# EAGLE design genericNode (EAGLE 7.3.0)
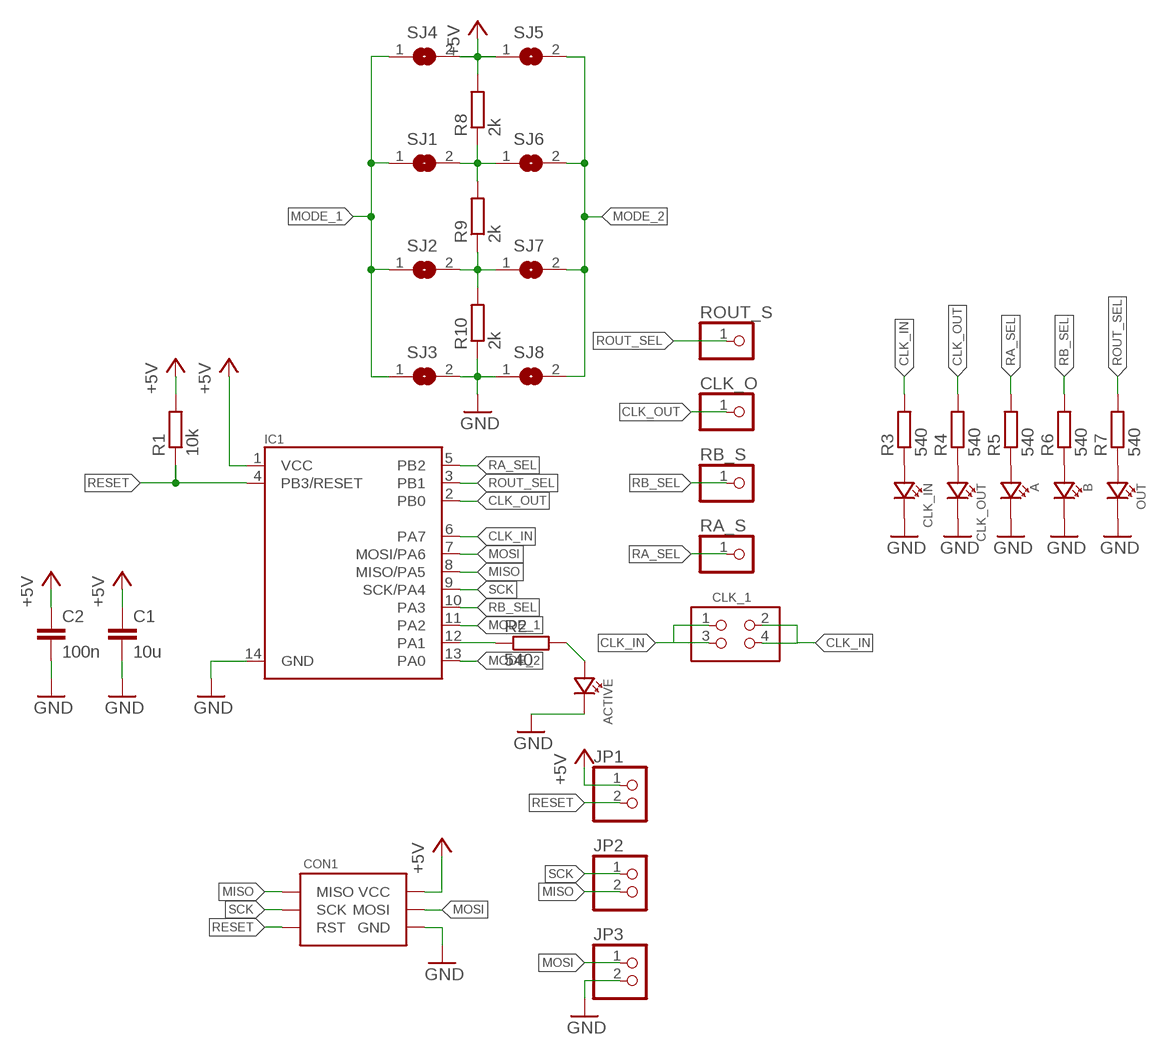
[diagram p0: schematic, sheet 1]

## Parts
A  LED0805  [CHIPLED_0805]
ACTIVE  LED0805  [CHIPLED_0805]
B  LED0805  [CHIPLED_0805]
C1  10u  C-EUC0805  [C0805]
C2  100n  C-EUC0603  [C0603]
CLK_1  GENERIC-2X2-EDGE  [PINHEADER-100MIL-2X2-EDGE]
CLK_IN  LED0805  [CHIPLED_0805]
CLK_O  PINHD-1X1  [1X01]
CLK_OUT  LED0805  [CHIPLED_0805]
CON1  ISP-6_PIN-POGO  [POGO-1.27-6_PIN-MADWORM]
IC1  AVR-ATTINY24/44/84-SOIC14  [SOIC14]
JP1  PINHD-1X2  [1X02]
JP2  PINHD-1X2  [1X02]
JP3  PINHD-1X2  [1X02]
OUT  LED0805  [CHIPLED_0805]
R1  10k  R-EU_R0603  [R0603]
R2  540  R-EU_R0603  [R0603]
R3  540  R-EU_R0603  [R0603]
R4  540  R-EU_R0603  [R0603]
R5  540  R-EU_R0603  [R0603]
R6  540  R-EU_R0603  [R0603]
R7  540  R-EU_R0603  [R0603]
R8  2k  R-EU_R0603  [R0603]
R9  2k  R-EU_R0603  [R0603]
R10  2k  R-EU_R0603  [R0603]
RA_S  PINHD-1X1  [1X01]
RB_S  PINHD-1X1  [1X01]
ROUT_S  PINHD-1X1  [1X01]
SJ1  SJ  [SJ]
SJ2  SJ  [SJ]
SJ3  SJ  [SJ]
SJ4  SJ  [SJ]
SJ5  SJ  [SJ]
SJ6  SJ  [SJ]
SJ7  SJ  [SJ]
SJ8  SJ  [SJ]

## Nets
+5V: C1.1 C2.1 CON1.P$2(VCC) IC1.1(VCC) JP1.1 R1.2 R8.2 SJ4.2 SJ5.1
CLK_IN: CLK_1.1 CLK_1.2 CLK_1.3 CLK_1.4 IC1.6(PA7) R3.2
CLK_OUT: CLK_O.1 IC1.2(PB0) R4.2
GND: A.C ACTIVE.C B.C C1.2 C2.2 CLK_IN.C CLK_OUT.C CON1.P$6(GND) IC1.14(GND) JP3.2 OUT.C R10.1 SJ3.2 SJ8.1
MISO: CON1.P$1(MISO) IC1.8(MISO/PA5) JP2.2
MODE_1: IC1.11(PA2) SJ1.1 SJ2.1 SJ3.1 SJ4.1
MODE_2: IC1.13(PA0) SJ5.2 SJ6.2 SJ7.2 SJ8.2
MOSI: CON1.P$4(MOSI) IC1.7(MOSI/PA6) JP3.1
N$1: ACTIVE.A R2.2
N$2: IC1.12(PA1) R2.1
N$3: CLK_IN.A R3.1
N$4: CLK_OUT.A R4.1
N$5: A.A R5.1
N$6: B.A R6.1
N$7: R9.1 R10.2 SJ2.2 SJ7.1
N$8: R8.1 R9.2 SJ1.2 SJ6.1
N$9: OUT.A R7.1
RA_SEL: IC1.5(PB2) R5.2 RA_S.1
RB_SEL: IC1.10(PA3) R6.2 RB_S.1
RESET: CON1.P$5(RST) IC1.4(PB3/RESET) JP1.2 R1.1
ROUT_SEL: IC1.3(PB1) R7.2 ROUT_S.1
SCK: CON1.P$3(SCK) IC1.9(SCK/PA4) JP2.1

## Library data of the parts
A ACTIVE B CLK_IN CLK_OUT OUT = p.peter-leds:LED
C1 C2 = p.peter-rcl:C-EU: CAPACITOR, European symbol
CLK_1 = p.peter-connectors:GENERIC-2X2
CLK_O RA_S RB_S ROUT_S = pinhead:PINHD-1X1: PIN HEADER
CON1 = p.peter-connectors:ISP-6_PIN: AVR 6 PIN ISP header Edge connector normal layout
IC1 = p.peter-ics:AVR-ATTINY24/44/84
JP1-JP3 = pinhead:PINHD-1X2: PIN HEADER
R1-R10 = p.peter-rcl:R-EU_: RESISTOR, European symbol
SJ1-SJ8 = jumper:SJ: SMD solder JUMPER

## Board
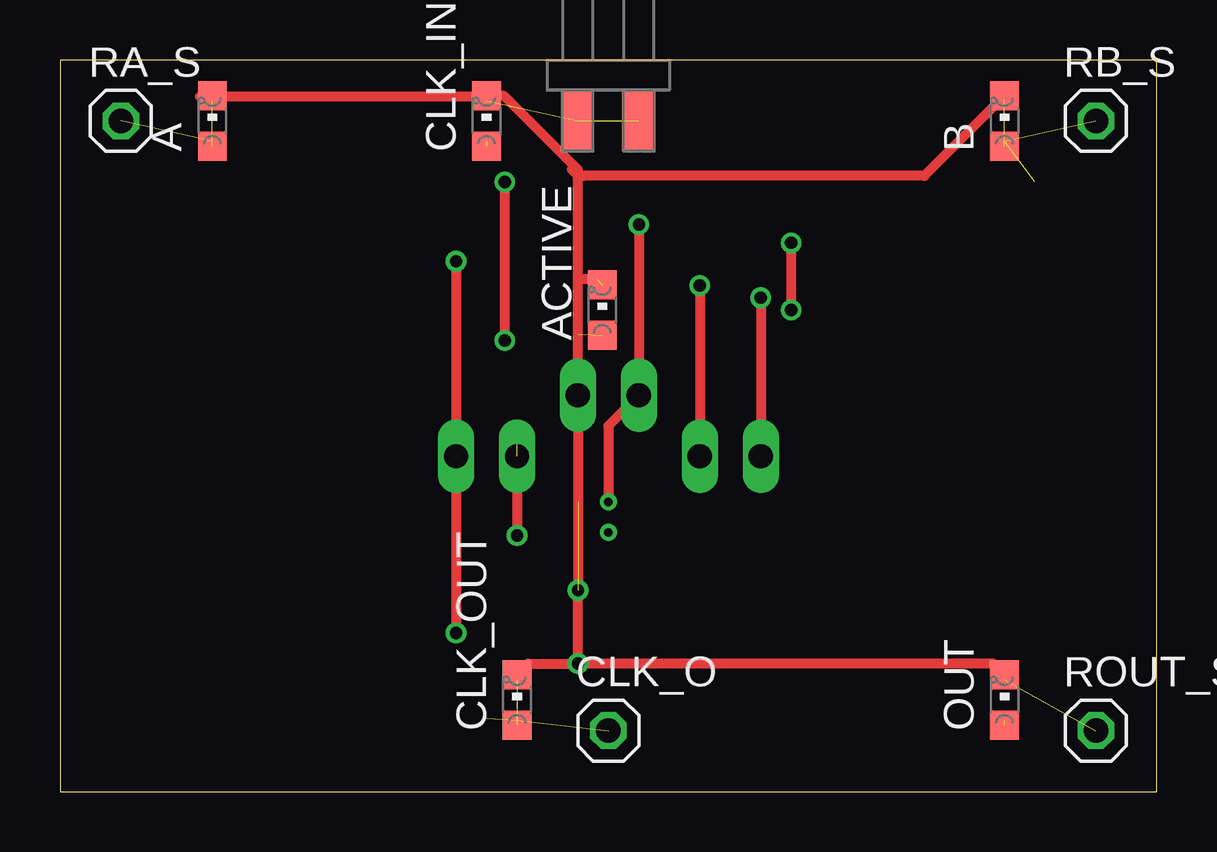
[diagram p1: board, top side]
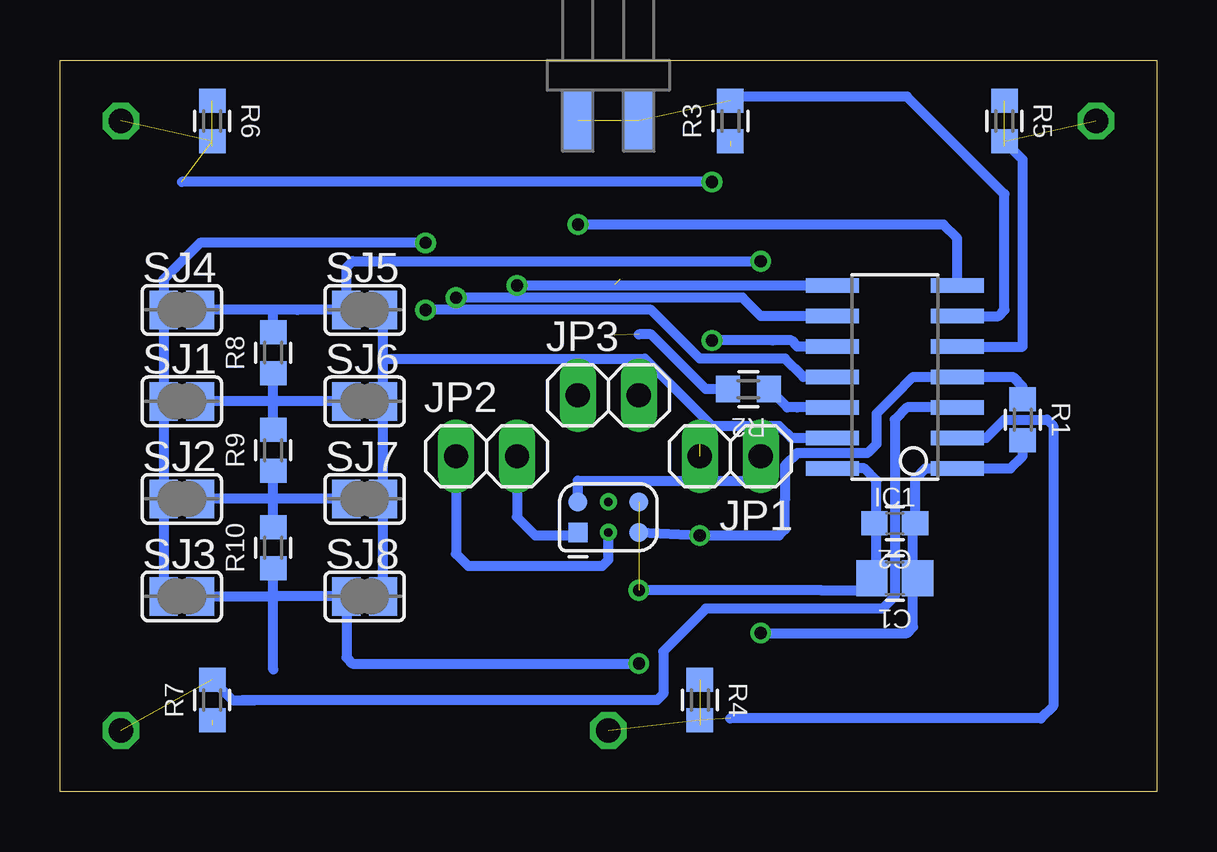
[diagram p2: board, bottom side, seen from below]

Size 45.72 x 30.48 mm. Coordinates in mm from the lower left corner, seen from the top.
Outline: 0,30.48 0,0
Outline: 5.08,30.48 0,30.48
Outline: 0,30.48 0,0
Outline: 0,0 45.72,0 45.72,30.48 5.08,30.48
Outline: 5.08,30.48 0,30.48
Copper layers (1*16): Top 0.0356mm / dielectric 1.5011mm / Bottom 0.0356mm
Design rules "oshpark": minimum track width 6mil, minimum drill 13mil, track to track 6mil, track to pad 6mil, pad to pad 6mil, via to via 6mil, smd to smd 6mil, copper to edge 15mil, drill to drill 6mil, minimum pad ring 7mil, minimum via ring 7mil, stop-mask expansion 4mil, vias tented up to drill 4.1mm, thermal gap 10mil

### Footprints (pad centres in the part's own frame; a part is rotated, then mirrored left to right if it is on the bottom)
CHIPLED_0805 = smd 1.2 x 1.2: A 0,-1.05; C 0,1.05
C0805 = smd 1.3 x 1.5: 1 -0.95,0; 2 0.95,0
C0603 = smd 1.1 x 1: 1 -0.85,0; 2 0.85,0
PINHEADER-100MIL-2X2-EDGE = smd 1.27 x 2.54 bottom: 1 -1.27,1.27; 3 1.27,1.27 | smd 1.27 x 2.54: 2 -1.27,1.27; 4 1.27,1.27
1X01 = drill 1.016 octagon: 1 0,0
POGO-1.27-6_PIN-MADWORM = smd 0.8 x 0.8: P$1 -1.27,-0.635; P$2 -1.27,0.635; P$5 1.27,-0.635; P$6 1.27,0.635 | drill 0.35: P$3 0,-0.635; P$4 0,0.635
SOIC14 = smd 0.61 x 2.21: 1 -3.81,-2.603; 2 -2.54,-2.603; 3 -1.27,-2.603; 4 0,-2.603; 5 1.27,-2.603; 6 2.54,-2.603; 7 3.81,-2.603; 8 3.81,2.603; 9 2.54,2.603; 10 1.27,2.603; 11 0,2.603; 12 -1.27,2.603; 13 -2.54,2.603; 14 -3.81,2.603
1X02 = drill 1.016 long: 1 -1.27,0; 2 1.27,0
R0603 = smd 1 x 1.1: 1 -0.85,0; 2 0.85,0
SJ = smd 1.168 x 1.6: 1 -0.762,0; 2 0.762,0

### Placement (x,y rotation side)
A  6.35,27.94 0 top
ACTIVE  22.61,20.07 0 top
B  39.37,27.94 0 top
C1  10.92,8.89 180 bottom
C2  10.92,11.18 180 bottom
CLK_1  22.86,29.21 180 top
CLK_IN  17.78,27.94 0 top
CLK_O  22.86,2.54 0 top
CLK_OUT  19.05,3.81 0 top
CON1  22.86,11.43 0 bottom
IC1  10.92,17.27 90 bottom
JP1  17.78,13.97 180 bottom
JP2  27.94,13.97 0 bottom
JP3  22.86,16.51 0 bottom
OUT  39.37,3.81 0 top
R1  5.59,15.49 270 bottom
R2  17.02,16.76 180 bottom
R3  17.78,27.94 90 bottom
R4  19.05,3.81 270 bottom
R5  6.35,27.94 270 bottom
R6  39.37,27.94 270 bottom
R7  39.37,3.81 90 bottom
R8  36.83,18.29 90 bottom
R9  36.83,14.22 90 bottom
R10  36.83,10.16 90 bottom
RA_S  2.54,27.94 0 top
RB_S  43.18,27.94 0 top
ROUT_S  43.18,2.54 0 top
SJ1  40.64,16.26 0 bottom
SJ2  40.64,12.19 0 bottom
SJ3  40.64,8.13 0 bottom
SJ4  40.64,20.07 0 bottom
SJ5  33.02,20.07 0 bottom
SJ6  33.02,16.26 0 bottom
SJ7  33.02,12.19 0 bottom
SJ8  33.02,8.13 0 bottom

### Tracks (layer width: path | path; a pad name or v marks a point on that pad's centre or on a via)
+5V  (via drill 0.51)
  Top 0.406: v16.51,6.6 JP1.1 v16.51,22.1
  Bottom 0.406: R1.2 5.59,13.97 6.1,13.46 IC1.1 9.65,13.46 10.07,13.04 C2.1 10.16,11.09 10.16,8.64 C1.1 | 10.16,8.45 C1.1 | 36.83,20.07 35.81,20.07 34.04,20.07 SJ5.1 33.78,21.84 33.53,22.1 v16.51,22.1 | 36.83,20.07 SJ4.2 | R8.2 36.83,20.07 | 9.91,8.57 C1.1 | v16.51,6.6 10.41,6.6 10.16,6.86 10.16,8.45 | 10.16,8.45 C1.1 | CON1.P$2 24.13,12.95 16.51,12.95 JP1.1
CLK_IN  (4 unrouted)
  Bottom 0.406: IC1.6 6.6,19.81 6.35,20.07 6.35,24.89 10.41,28.96 17.61,28.96 R3.2
CLK_OUT  (2 unrouted)
  Bottom 0.406: IC1.2 7.11,14.73 6.35,15.49 4.57,15.49 4.32,15.24 4.32,3.56 4.83,3.05 17.78,3.05
GND  (via drill 0.51)  (2 unrouted)
  Top 0.406: v21.59,5.33 v21.59,8.38 JP3.2 21.59,21.34 | 21.59,21.34 21.59,25.65 | 21.59,25.65 21.59,25.91 18.51,28.99 CLK_IN.C 17.75,28.96 5.84,28.96 5.88,28.99 A.C | B.C 36.03,25.65 21.84,25.65 | 21.84,25.65 21.59,25.65 | 21.59,25.65 21.34,25.91 21.59,25.65 | 21.59,25.65 21.84,25.65 | 22.39,21.34 21.59,21.34 | CLK_OUT.C 19.52,5.33 v21.59,5.33 | OUT.C 38.9,5.33 v21.59,5.33
  Bottom 0.406: C1.2 11.68,8.64 11.68,11.01 C2.2 11.68,11.18 11.68,12.95 12.19,13.46 IC1.14 | 11.68,8.45 C1.2 | 36.83,5.08 36.83,8.13 | 36.83,8.13 R10.1 | SJ3.2 36.83,8.13 | 36.83,8.13 SJ8.1 33.78,5.59 33.53,5.33 v21.59,5.33 | C1.2 12.13,8.38 13.97,8.38 v21.59,8.38
MISO  (via drill 0.51)
  Top 0.406: v26.67,21.08 JP2.2
  Bottom 0.406: JP2.2 26.67,11.43 25.91,10.67 24.26,10.67 CON1.P$1 | IC1.8 v26.67,21.08
MODE_1  (via drill 0.51)
  Top 0.406: v30.48,20.07 30.48,21.59 v30.48,22.86
  Bottom 0.406: SJ3.1 SJ2.1 SJ1.1 SJ4.1 41.4,21.34 40.89,21.84 39.88,22.86 v30.48,22.86 | IC1.11 14.73,17.27 15.49,18.03 19.05,18.03 21.08,20.07 30.23,20.07 v30.48,20.07
MODE_2
  Bottom 0.406: SJ8.2 SJ7.2 SJ6.2 | SJ6.2 32.26,18.03 | 32.26,18.03 SJ5.2 | SJ6.2 32.26,18.03 | 32.26,18.03 21.34,18.03 19.81,16.51 18.54,15.24 15.75,15.24 15.24,14.73 13.97,14.73 IC1.13
MOSI  (via drill 0.51)
  Top 0.406: v24.13,23.62 JP3.1 22.86,15.24 CON1.P$4
  Bottom 0.406: IC1.7 8.32,23.05 8.89,23.62 v24.13,23.62
N$1  (1 unrouted)
  Bottom 0.406: R2.2 18.8,16.76 21.08,19.05 21.59,19.05
N$2
  Bottom 0.406: IC1.12 14.99,16 15.41,16 R2.1
N$3  (1 unrouted)
N$4  (1 unrouted)
N$5  (1 unrouted)
N$6  (1 unrouted)
N$7
  Bottom 0.406: R10.2 36.83,12.19 | 36.83,12.19 R9.1 | SJ7.1 36.83,12.19 | 36.83,12.19 SJ2.2
N$8
  Bottom 0.406: R9.2 36.83,16.26 | 36.83,16.26 R8.1 | SJ6.1 36.83,16.26 | 36.83,16.26 SJ1.2
N$9  (1 unrouted)
RA_SEL  (1 unrouted)
  Bottom 0.406: IC1.5 5.59,18.54 5.59,26.33 R5.2
RB_SEL  (via drill 0.51)  (2 unrouted)
  Top 0.406: v18.54,18.8 v18.54,25.4
  Bottom 0.406: IC1.10 14.99,18.54 15.24,18.8 16,18.8 v18.54,18.8 | v18.54,25.4 40.64,25.4
RESET  (via drill 0.51)  (2 unrouted)
  Top 0.406: JP1.2 v19.05,10.67
  Bottom 0.406: R1.1 5.59,16.85 6.01,17.27 IC1.4 10.16,17.27 10.92,16.51 11.68,15.75 11.68,14.48 12.06,14.1 14.99,14.1 15.49,13.59 15.49,13.21 15.49,12.7 15.49,12.45 15.49,12.19 15.49,10.92 15.75,10.67 v19.05,10.67 CON1.P$5
ROUT_SEL  (1 unrouted)
  Bottom 0.406: IC1.3 10.41,16 10.92,15.49 10.92,8.13 11.43,7.62 18.8,7.62 20.57,5.84 20.57,4.06 20.83,3.81 37.59,3.81 | 37.59,3.81 38.1,3.81 | R7.2 38.52,3.81 37.59,3.81
SCK  (via drill 0.51)
  Top 0.406: v29.21,20.57 JP2.1
  Bottom 0.406: JP2.1 29.21,9.91 28.7,9.4 23.11,9.4 22.86,9.65 CON1.P$3 | IC1.9 16.51,19.81 17.27,20.57 21.34,20.57 v29.21,20.57